# Altium project Weather_Station_ETH.PRJPCB (part 2 of 2)

## Sheet Temp_hum_sensor.SchDoc
size A4
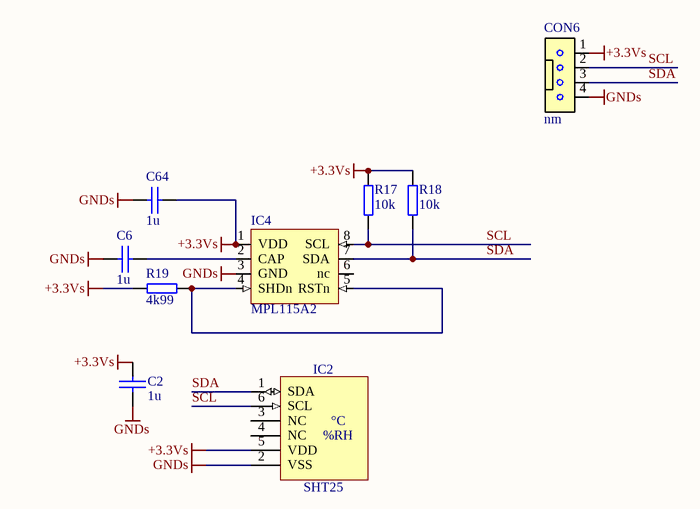
[diagram p8: Temp_hum_sensor.SchDoc]

### Parts
C2  1u  [0603C]
C6  1u  [0603C]
C64  1u  [0603C]
CON6  nm  [WZ04S]
IC2  SHT25  [SENSIRION_SHT2X]
IC4  MPL115A2  [LGA8]
R17  10k  [0402R]
R18  10k  [0402R]
R19  4k99  [0603R]

### Nets
+3.3Vs: C2.2 C64.2 CON6.1 IC2.5(VDD) IC4.1(VDD) R17.2 R18.2 R19.2
GNDs: C2.1 C6.1 C64.1 CON6.4 IC2.2(VSS) IC4.3(GND)
SCL: CON6.2 IC2.6(SCL) IC4.8(SCL) R17.1
SDA: CON6.3 IC2.1(SDA) IC4.7(SDA) R18.1
NetC6_2: C6.2 IC4.2(CAP)
NetIC4_4: IC4.4(SHDn) IC4.5(RSTn) R19.1

Not connected (* = marked no-connect by the designer): IC2 3(NC) 4(NC); IC4 6(nc)

### Notes on the sheet
- (in symbol SHT25) °C; %RH

### Library data of the parts
C2 C6 C64 = CAP_SMD_0603: Capacitor SMD; Supplier 1: Digi-Key; Supplier Part Number 1: 490-1524-2-ND
CON6 = CON_4_2.54_key: 2.54mm crimped terminal header
IC2 = SHT25: Humidity and Temperature Sensor IC; Part Description: I2C Digital Humidity 0 – 100% RH and Temperature -40°C to +125°C Sensor; Manufacturer: SENSIRION; Table: Sensors; Part Number: SHT25; Component Kind: Standard; Component Type: Standard; Device: SHT25; PackageDescription: SON, 1.00mm, Pitch; 6 Pin, 3.00mm W X 3.00mm L X 1.20mm H body (W/Thermal Tab 1.40 X 2.3mm), SEMIRION DFN; Manufacturer Part Number: SHT25; Pin Count: 6; Case: SON6; Mounted: Yes; Socket: No; SMD: Yes; ComponentHeight: 1.2mm; HelpURL: \\cern.ch\dfs\Applications\Altium\Datasheets\SHT25.pdf; Author: CERN DEM JLC; CreateDate: 2012-04-19; LatestRevisionDate: 2012-04-19
IC4 = SENS_MPL115A2: Miniature I2C Digital Barometer
R17 R18 = RES_0402: SMD Resistor; Supplier 1: Newark; Supplier Part Number 1: 59M6691
R19 = RES_0603: SMD Resistor; Supplier 1: Newark; Supplier Part Number 1: 39K0073

## Sheet ACC_charger.SchDoc
size A4
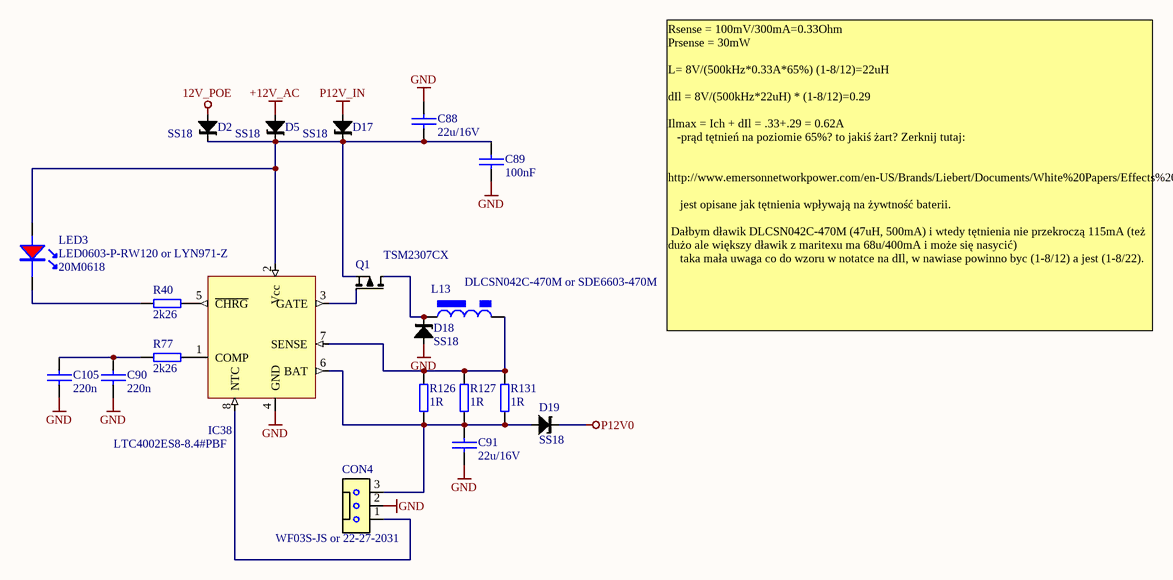
[diagram p9: ACC_charger.SchDoc]

### Parts
C88  22u/16V  [1206C]
C89  100nF  [0402C]
C90  220n  [0603C]
C91  22u/16V  [1206C]
C105  220n  [0603C]
CON4  WF03S-JS or 22-27-2031  [CON_WF03S-LF]
D2  SS18  [DO-214AC/SMA]
D5  SS18  [DO-214AC/SMA]
D17  SS18  [DO-214AC/SMA]
D18  SS18  [DO-214AC/SMA]
D19  SS18  [DO-214AC/SMA]
IC38  LTC4002ES8-8.4#PBF  [SO-8]
L13  DLCSN042C-470M or SDE6603-470M  [L_DLCSN042C]
LED3  LED0603-P-RW120 or LYN971-Z  Supplier Part Number 2: 20M0618  [led_0603R]
Q1  TSM2307CX  [sot-23]
R40  2k26  [0603R]
R77  2k26  [0603R]
R126  1R  [0603R]
R127  1R  [0603R]
R131  1R  [0603R]

### Nets
12V_POE: D2.A
+12V_AC: D5.A
GND: C88.1 C89.2 C90.2 C91.2 C105.2 CON4.2 D18.A IC38.4(GND)
P12V0: D19.K
P12V_IN: D17.A
NetC88_2: C88.2 C89.1 D2.K D5.K D17.K IC38.2(Vcc) LED3.A Q1.2(S)
NetC90_1: C90.1 C105.1 R77.1
NetC91_1: C91.1 CON4.3 D19.A IC38.6(BAT) R126.1 R127.1 R131.1
NetCON4_1: CON4.1 IC38.8(NTC)
NetD18_K: D18.K L13.1 Q1.3(D)
NetIC38_1: IC38.1(COMP) R77.2
NetIC38_3: IC38.3(GATE) Q1.1(G)
NetIC38_5: IC38.5(~{CHRG}) R40.2
NetIC38_7: IC38.7(SENSE) L13.2 R126.2 R127.2 R131.2
NetLED3_K: LED3.K R40.1

### Notes on the sheet
- Rsense = 100mV/300mA=0.33Ohm
  Prsense = 30mW
  L= 8V/(500kHz*0.33A*65%) (1-8/12)=22uH
  dIl = 8V/(500kHz*22uH) * (1-8/12)=0.29
  Ilmax = Ich + dIl = .33+.29 = 0.62A
  -prąd tętnień na poziomie 65%? to jakiś żart? Zerknij tutaj:
  http://www.emersonnetworkpower.com/en-US/Brands/Liebert/Documents/White%20Papers/Effects%20of%20AC%20Ripple%20Current%20on%20VRLA%20Battery%20Life.pdf
  jest opisane jak tętnienia wpływają na żywtność baterii.
  Dałbym dławik DLCSN042C-470M (47uH, 500mA) i wtedy tętnienia nie przekroczą 115mA (też dużo ale większy dławik z maritexu ma 68u/400mA i może się nasycić)
  taka mała uwaga co do wzoru w notatce na dIl, w nawiase powinno byc (1-8/12) a jest (1-8/22).

### Library data of the parts
C88 C91 = CAP_SMD_1206: Capacitor SMD; Supplier 1: Newark; Supplier Part Number 1: 90R7810
C89 = CAP_SMD_0402: Capacitor SMD; Supplier 1: Newark; Supplier Part Number 1: 14T3275
C90 C105 = CAP_SMD_0603: Capacitor SMD
CON4 = CON_3_2.54_key: 2.54mm crimped terminal header; Supplier 1: Newark; Supplier Part Number 1: 13T6895
D2 D5 D17-D19 = shottky_SS14_18: shottky diode (Maritex)
IC38 = PM_LTC4002ES8-8.4: Standalone Li-Ion  Switch Mode Battery Charger; Supplier 1: Newark; Supplier Part Number 1: 58M0818
L13 = L_POWER_DLCSN042C_47uH: 47uH, 0.5A, 0.64R, inductor (Maritex); Supplier 1: Newark; Supplier Part Number 1: 74R9579
LED3 = LED_0603R: LED 0603 red; Supplier 1: Newark; Supplier Part Number 1: 22M3004; Supplier 2: Newark
Q1 = Q_TSM2307CX: P MOSFET 30V, 0.14R, 2A; Supplier 1: Newark; Supplier Part Number 1: 27T2994
R40 R77 R126 R127 R131 = RES_0603: SMD Resistor; Supplier 1: Newark; Supplier Part Number 1: 39K0073

## Nets that join several sheets
12V_POE: supply (7 pins), ACC_charger (D2.A)
+12V_AC: supply (D3.A), AC_SUPPLY (7 pins), ACC_charger (D5.A)
GND: ETH_Wifi (77 pins), sensors (17 pins), supply (30 pins), MEAS_CPU (28 pins), AC_SUPPLY (10 pins), GPRS (44 pins), RS422 (9 pins), ACC_charger (8 pins)
P3V3: ETH_Wifi (46 pins), sensors (34 pins), supply (C26.1 C27.1 C28.1 IC3.2), MEAS_CPU (18 pins), RS422 (C42.2 IC15.14 R16.2)
P5V0: ETH_Wifi (7 pins), sensors (Jmp1.3 Jmp2.3 Jmp3.3 Jmp4.3), supply (5 pins)
P12V0: ETH_Wifi (R8.2), supply (9 pins), MEAS_CPU (R149.2), GPRS (C109.1 C181.2 IC27.2), RS422 (F7.1), ACC_charger (D19.K)
P12V_IN: supply (D1.A D9.K F3.2), ACC_charger (D17.A)
ADC0_in: sensors (R30.2), MEAS_CPU (C115.2 IC14.21)
ADC1_in: sensors (R67.2), MEAS_CPU (C116.2 IC14.22)
ADC2_in: sensors (R69.2), MEAS_CPU (C117.2 IC14.23)
ADC3_in: sensors (R71.2), MEAS_CPU (C118.2 IC14.24)
ADC5_in: sensors (R68.2), MEAS_CPU (C120.2 IC14.26)
ADC6_in: sensors (R75.2), MEAS_CPU (C121.2 IC14.20)
ADC7_in: sensors (R70.2), MEAS_CPU (C122.2 IC14.27)
BOOT_SEL: sensors (IC6.6 IC7.19 IC8.6), MEAS_CPU (5 pins)
CTS1: ETH_Wifi (IC1.43), GPRS (R50.1)
modem_pow_ON: ETH_Wifi (IC1.39), GPRS (R58.1)
NetIC1_47: ETH_Wifi (IC1.47), GPRS (R54.1)
NetIC1_48: ETH_Wifi (IC1.48), GPRS (R51.1)
NetIC1_49: ETH_Wifi (IC1.49), GPRS (Q4.1 R159.1)
NetIC1_69: ETH_Wifi (IC1.69), GPRS (R53.1)
NetIC6_3: sensors (IC6.3), MEAS_CPU (IC14.11 R78.1)
NetIC6_9: sensors (IC6.9 IC8.9), MEAS_CPU (IC14.14)
NetIC6_10: sensors (IC6.10 IC8.10), MEAS_CPU (IC14.13)
NetIC6_13: sensors (IC6.13), MEAS_CPU (IC14.10 R76.1)
NetIC8_13: sensors (IC8.13), MEAS_CPU (IC14.8)
NetIC40_1: ETH_Wifi (IC40.1 R152.1), RS422 (R37.1)
NetIC40_2: ETH_Wifi (IC40.2), GPRS (R49.1)
NetIC40_3: ETH_Wifi (IC40.3 R153.1), RS422 (R25.1)
NetIC40_5: ETH_Wifi (IC40.5), GPRS (R48.1)
NetJ6_4: ETH_Wifi (J6.4), supply (L3.4)
NetJ6_5: ETH_Wifi (J6.5), supply (L3.1)
NetJ6_7: ETH_Wifi (J6.7), supply (L1.4)
NetJ6_8: ETH_Wifi (J6.8), supply (L1.1)
RESETn: ETH_Wifi (C33.1 IC1.7 R1.1 S1.2), MEAS_CPU (R107.1)
RS0_485_DE: ETH_Wifi (IC1.71), RS422 (R23.1 R150.1)
RTS1: ETH_Wifi (IC1.44), GPRS (R52.1)
RXD2: ETH_Wifi (IC1.52 R153.2), MEAS_CPU (R106.1)
SPI_MISO: sensors (IC8.3), MEAS_CPU (IC14.17 IC16.2 IC24.7 IC26.2)
SPI_MOSI: sensors (IC7.2 IC7.4 IC7.6 IC7.8), MEAS_CPU (IC14.18 IC16.5 IC24.6 IC26.5)
SPI_SCK: sensors (IC7.11 IC7.13 IC7.15 IC7.17), MEAS_CPU (IC14.15 IC16.6 IC24.5 IC26.6)
STATUS: ETH_Wifi (IC1.50), GPRS (IC11.12 IC12.22 Q3.1)
SWDIO: sensors (R32.2), MEAS_CPU (C119.2 CON3.5 IC14.25)
TXD2: ETH_Wifi (IC1.70 R152.2), MEAS_CPU (R105.1)

## Assembly variants
FULL (PIC+LPC+GPRS+ACC_charger+POE+AC_supply+LCD+WiFi+RFMD70): not fitted CON1 CON3
MIINI (PIC+LPC+POE+AC_supply): not fitted ANT1 C45 C46 C48 C58 C59 C60 C61 C62 C63 C88 C89 C90 C91 C97 C98 C101 C105 C109 C112 C162 C163 C164 C181 CON1 CON2 CON3 CON4 D2 D5 D17 D18 D19 DISP1 IC11 IC12 IC24 IC27 IC36 IC38 J8 JP2 L9 L12 L13 LED3 LED5 LED6 Q1 Q2 Q3 Q4 Q8 R33 R35 R36 R40 R46 R48 R49 R50 R51 R52 R53 R54 R55 R56 R57 R58 R59 R60 R61 R62 R63 R64 R65 R66 R77 R124 R126 R127 R131 R132 R133 R159 R163 RT1